# EAGLE schematic esp32-controller (EAGLE 9.6.2)
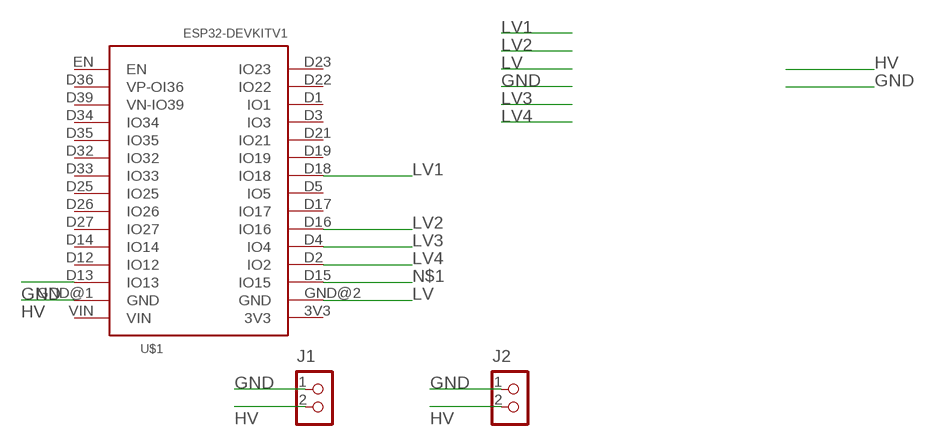
[diagram p0: schematic, sheet 1]

## Parts
J1  CON_TERMINAL_BLOCK_02-5MM  [TERMINAL_BLOCK_2P_5]
J2  CON_TERMINAL_BLOCK_02-5MM  [TERMINAL_BLOCK_2P_5]
U$1  ESP32DEVKITV1  [ESP32-DEVKITV1]

## Nets
GND: J1.1 J2.1 U$1.D13(IO13)
HV: J1.2 J2.2 U$1.GND@1(GND)
LV: U$1.GND@2(GND)
LV1: U$1.D18(IO18)
LV2: U$1.D16(IO16)
LV3: U$1.D4(IO4)
LV4: U$1.D2(IO2)
N$1: U$1.D15(IO15)
Unconnected: U$1.3V3 U$1.D1(IO1) U$1.D3(IO3) U$1.D5(IO5) U$1.D12(IO12) U$1.D14(IO14) U$1.D17(IO17) U$1.D19(IO19) U$1.D21(IO21) U$1.D22(IO22) U$1.D23(IO23) U$1.D25(IO25) U$1.D26(IO26) U$1.D27(IO27) U$1.D32(IO32) U$1.D33(IO33) U$1.D34(IO34) U$1.D35(IO35) U$1.D36(VP-OI36) U$1.D39(VN-IO39) U$1.EN U$1.VIN

## Library data of the parts
J1 J2 = tblok:CON_TERMINAL_BLOCK_02: 2 poles wire to board terminal block
U$1 = esp32-devkit:ESP32DEVKITV1